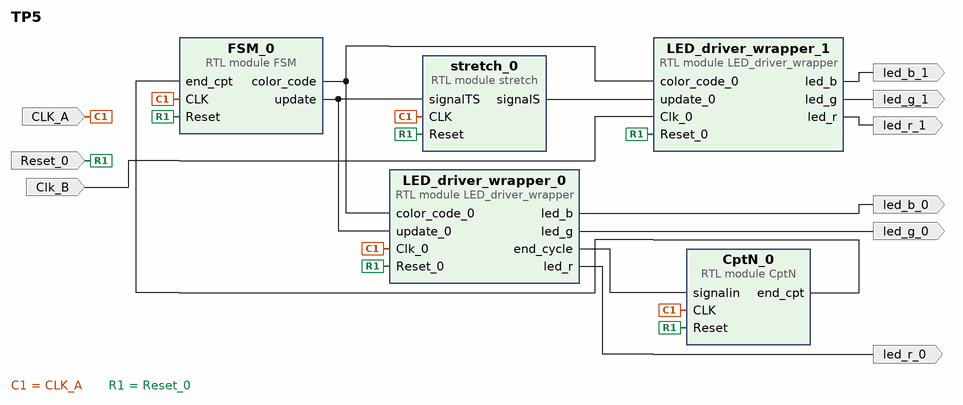
[diagram p0: block diagram of the top level]
# Vivado block design TP5, xc7z010clg400-1, Vivado 2024.1
create_bd_design TP5

create_bd_port -dir I -type clk CLK_A
create_bd_port -dir I -type rst Reset_0
create_bd_port -dir O led_b_0
create_bd_port -dir O led_g_0
create_bd_port -dir O led_r_0
create_bd_port -dir O led_b_1
create_bd_port -dir O led_g_1
create_bd_port -dir O led_r_1
create_bd_port -dir I Clk_B

create_bd_cell -type module -reference LED_driver_wrapper LED_driver_wrapper_0
create_bd_cell -type module -reference LED_driver_wrapper LED_driver_wrapper_1
create_bd_cell -type module -reference CptN CptN_0
create_bd_cell -type module -reference FSM FSM_0
create_bd_cell -type module -reference stretch stretch_0

# ---- connections ----

connect_bd_net -net CLK_0_1 [get_bd_ports CLK_A] \
  [get_bd_pins CptN_0/CLK] [get_bd_pins LED_driver_wrapper_0/Clk_0] [get_bd_pins stretch_0/CLK] [get_bd_pins FSM_0/CLK]
connect_bd_net -net Clk_0_0_1 [get_bd_ports Clk_B] [get_bd_pins LED_driver_wrapper_1/Clk_0]
connect_bd_net [get_bd_pins CptN_0/end_cpt] [get_bd_pins FSM_0/end_cpt]
connect_bd_net [get_bd_pins FSM_0/color_code] [get_bd_pins LED_driver_wrapper_0/color_code_0] [get_bd_pins LED_driver_wrapper_1/color_code_0]
connect_bd_net [get_bd_pins FSM_0/update] [get_bd_pins LED_driver_wrapper_0/update_0] [get_bd_pins stretch_0/signalTS]
connect_bd_net [get_bd_pins LED_driver_wrapper_0/end_cycle] [get_bd_pins CptN_0/signalin]
connect_bd_net [get_bd_pins LED_driver_wrapper_0/led_b] [get_bd_ports led_b_0]
connect_bd_net [get_bd_pins LED_driver_wrapper_0/led_g] [get_bd_ports led_g_0]
connect_bd_net [get_bd_pins LED_driver_wrapper_0/led_r] [get_bd_ports led_r_0]
connect_bd_net [get_bd_pins LED_driver_wrapper_1/led_b] [get_bd_ports led_b_1]
connect_bd_net [get_bd_pins LED_driver_wrapper_1/led_g] [get_bd_ports led_g_1]
connect_bd_net [get_bd_pins LED_driver_wrapper_1/led_r] [get_bd_ports led_r_1]
connect_bd_net -net Reset_0_1 [get_bd_ports Reset_0] \
  [get_bd_pins LED_driver_wrapper_0/Reset_0] [get_bd_pins LED_driver_wrapper_1/Reset_0] [get_bd_pins CptN_0/Reset] \
  [get_bd_pins stretch_0/Reset] [get_bd_pins FSM_0/Reset]
connect_bd_net [get_bd_pins stretch_0/signalS] [get_bd_pins LED_driver_wrapper_1/update_0]

validate_bd_design
save_bd_design
